# Altium schematic sheet Sheet_1_2022-06-12-2.schdoc
size 54 x 42 mm
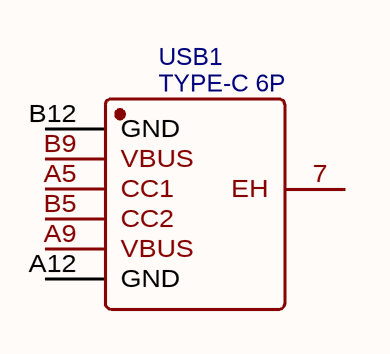
[diagram p0: Sheet_1_2022-06-12-2.schdoc]

## Parts
USB1  TYPE-C 6P  [TYPE-C-SMD_TYPE-C-6P]

## Nets

Not connected (* = marked no-connect by the designer): USB1 7(EH) A5(CC1) A9(VBUS) A12(GND) B5(CC2) B9(VBUS) B12(GND)

## Library data of the parts
USB1 = TYPE-C 6P: BOM_Manufacturer: SHOU HAN; Contributor: LCSC; BOM_Supplier: LCSC; BOM_Supplier Part: C456012; BOM_Manufacturer Part: TYPE-C 6P; BOM_JLCPCB Part Class: Extended Part; spicePre: U; spiceSymbolName: TYPE-C 6P